# Altium schematic sheet AFE.SchDoc: Chargeur cellules lithium
size Legal; DocumentNumber: 6; SheetNumber: 6; SheetTotal: 8; Version: Gamma 1.0; Conceptor: Philippe Turgeon
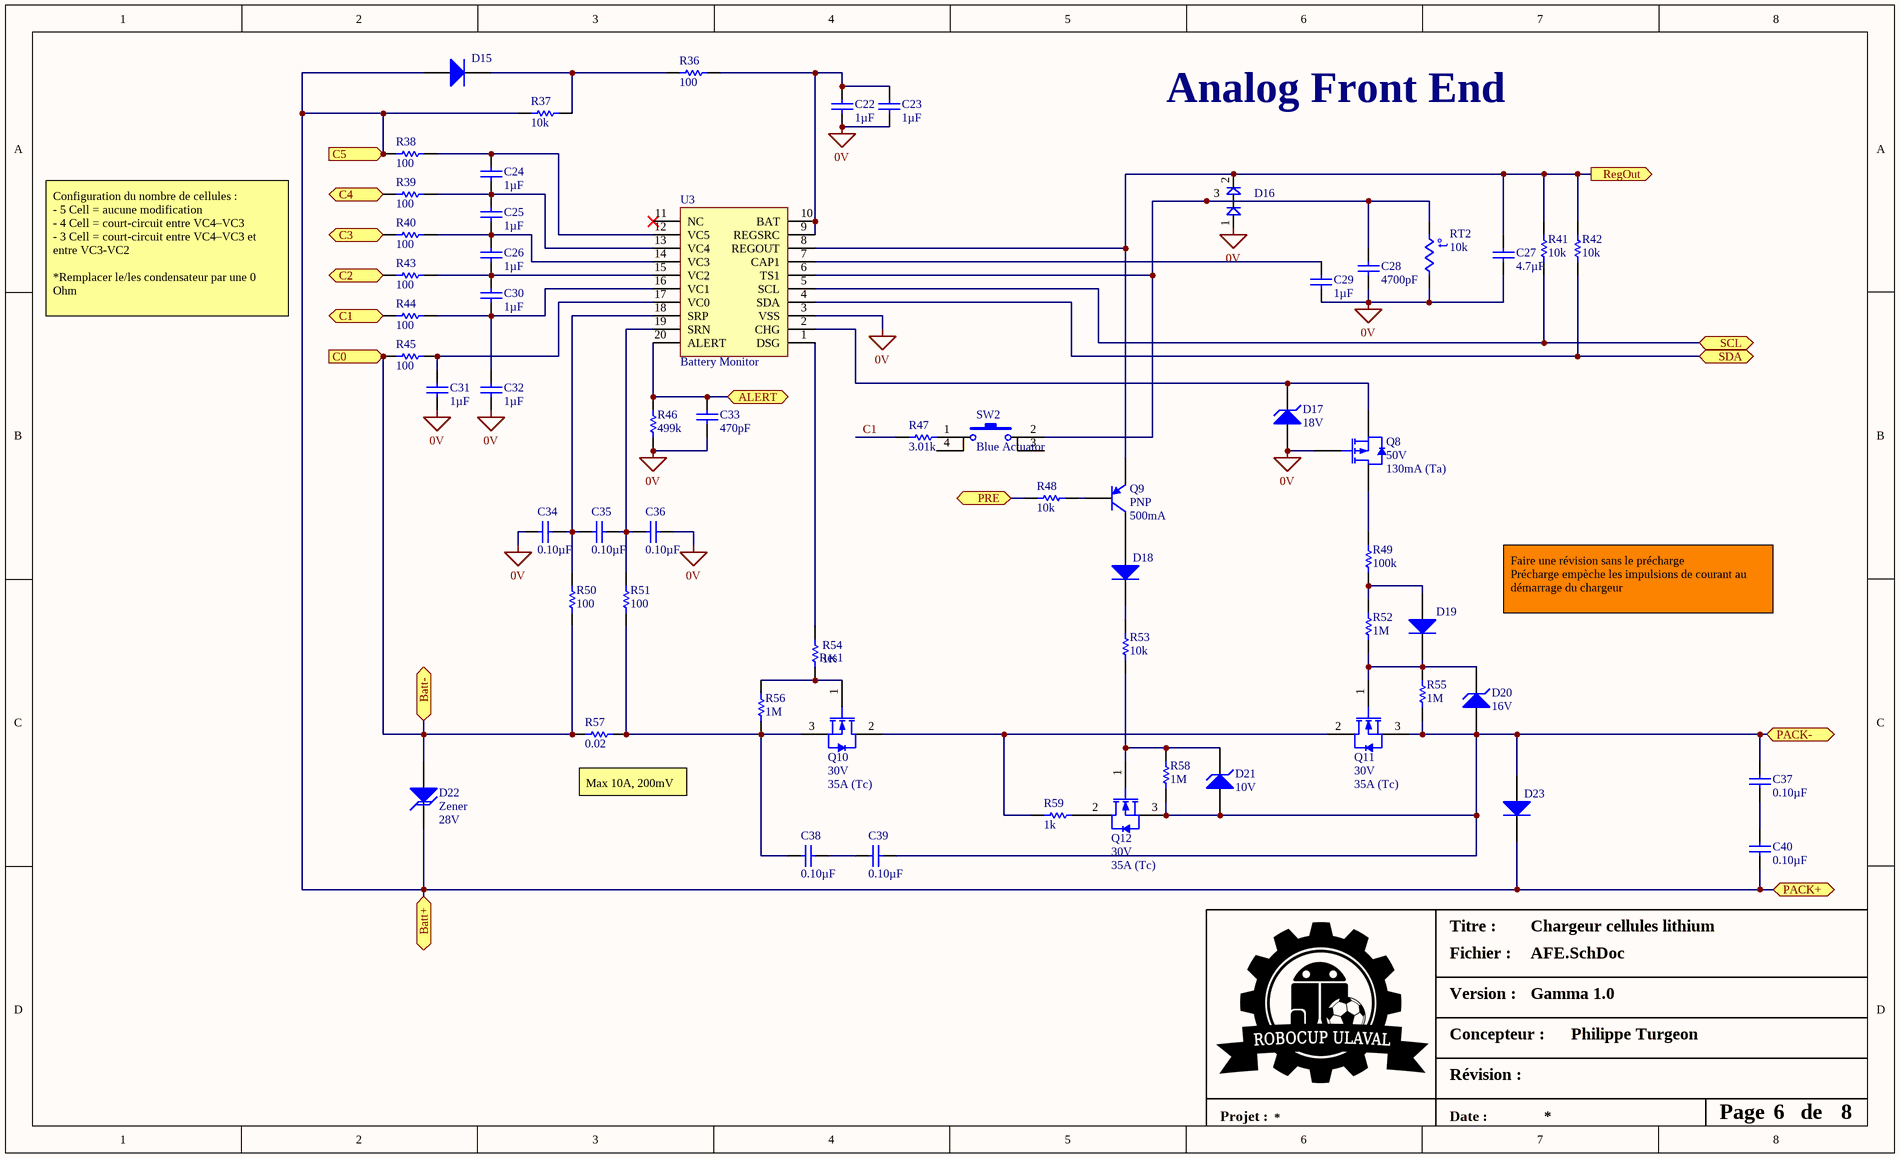
[diagram p0: AFE.SchDoc]

## Parts
C22  Capacitance: 1µF  [0805]  (hidden comment: CL21B105KBFNFNE)
C23  Capacitance: 1µF  [0805]  (hidden comment: CL21B105KBFNFNE)
C24  Capacitance: 1µF  [0805]  (hidden comment: CL21B105KBFNFNE)
C25  Capacitance: 1µF  [0805]  (hidden comment: CL21B105KBFNFNE)
C26  Capacitance: 1µF  [0805]  (hidden comment: CL21B105KBFNFNE)
C27  Capacitance: 4.7µF  [1206]  (hidden comment: CL31B475KBHNNNE)
C28  Capacitance: 4700pF  [0603]  (hidden comment: CL10B472KB8NNNC)
C29  Capacitance: 1µF  [0805]  (hidden comment: CL21B105KBFNFNE)
C30  Capacitance: 1µF  [0805]  (hidden comment: CL21B105KBFNFNE)
C31  Capacitance: 1µF  [0805]  (hidden comment: CL21B105KBFNFNE)
C32  Capacitance: 1µF  [0805]  (hidden comment: CL21B105KBFNFNE)
C33  Capacitance: 470pF  [0603]  (hidden comment: CL10B471KB8NNNC)
C34  Capacitance: 0.10µF  [0603]  (hidden comment: CL10B104KB8SFNC)
C35  Capacitance: 0.10µF  [0603]  (hidden comment: CL10B104KB8SFNC)
C36  Capacitance: 0.10µF  [0603]  (hidden comment: CL10B104KB8SFNC)
C37  Capacitance: 0.10µF  [0603]  (hidden comment: CL10B104KB8SFNC)
C38  Capacitance: 0.10µF  [0603]  (hidden comment: CL10B104KB8SFNC)
C39  Capacitance: 0.10µF  [0603]  (hidden comment: CL10B104KB8SFNC)
C40  Capacitance: 0.10µF  [0603]  (hidden comment: CL10B104KB8SFNC)
D15  1N4148W-7-F  [SOD123]  (value not drawn)
D16  BAV99LT1G  [SOT-23-3]  (value not drawn)
D17  Voltage - Zener (Nom) (Vz): 18V  [SOD-323F]  (hidden comment: DZ2J180M0L)
D18  1N4148W-7-F  [SOD123]  (value not drawn)
D19  1N4148W-7-F  [SOD123]  (value not drawn)
D20  Voltage - Zener (Nom) (Vz): 16V  [SOD-323F]  (hidden comment: DZ2J160M0L)
D21  Voltage - Zener (Nom) (Vz): 10V  [SOD-323F]  (hidden comment: DZ2J100M0L)
D22  Type: Zener  Voltage - Reverse Standoff (Typ): 28V  [SMC]  (hidden comment: SMCJ28A-TR)
D23  1N4148W-7-F  [SOD123]  (value not drawn)
Q8  Drain to Source Voltage (Vdss): 50V  Current - Continuous Drain (Id) @ 25°C: 130mA (Ta)  [SOT-23-3]  (hidden comment: BSS84-7-F)
Q9  Transistor Type: PNP  Current - Collector (Ic) (Max): 500mA  [SOT-23-3]  (hidden comment: MMBTA92LT1G)
Q10  Drain to Source Voltage (Vdss): 30V  Current - Continuous Drain (Id) @ 25°C: 35A (Tc)  [PowerPAK 1212-8]  (hidden comment: SI7114ADN-T1-GE3)
Q11  Drain to Source Voltage (Vdss): 30V  Current - Continuous Drain (Id) @ 25°C: 35A (Tc)  [PowerPAK 1212-8]  (hidden comment: SI7114ADN-T1-GE3)
Q12  Drain to Source Voltage (Vdss): 30V  Current - Continuous Drain (Id) @ 25°C: 35A (Tc)  [PowerPAK 1212-8]  (hidden comment: SI7114ADN-T1-GE3)
R36  Resistance (Ohms): 100  [0603]  (hidden comment: RC0603FR-07100RL)
R37  Resistance (Ohms): 10k  [0603]  (hidden comment: RC0603JR-0710KL)
R38  Resistance (Ohms): 100  [0603]  (hidden comment: RC0603FR-07100RL)
R39  Resistance (Ohms): 100  [0603]  (hidden comment: RC0603FR-07100RL)
R40  Resistance (Ohms): 100  [0603]  (hidden comment: RC0603FR-07100RL)
R41  Resistance (Ohms): 10k  [0603]  (hidden comment: RC0603JR-0710KL)
R42  Resistance (Ohms): 10k  [0603]  (hidden comment: RC0603JR-0710KL)
R43  Resistance (Ohms): 100  [0603]  (hidden comment: RC0603FR-07100RL)
R44  Resistance (Ohms): 100  [0603]  (hidden comment: RC0603FR-07100RL)
R45  Resistance (Ohms): 100  [0603]  (hidden comment: RC0603FR-07100RL)
R46  Resistance (Ohms): 499k  [0603]  (hidden comment: RC0603FR-07499KL)
R47  Resistance (Ohms): 3.01k  [0603]  (hidden comment: RC0603FR-073K01L)
R48  Resistance (Ohms): 10k  [0603]  (hidden comment: RC0603JR-0710KL)
R49  Resistance (Ohms): 100k  [0603]  (hidden comment: RC0603JR-07100KL)
R50  Resistance (Ohms): 100  [0603]  (hidden comment: RC0603FR-07100RL)
R51  Resistance (Ohms): 100  [0603]  (hidden comment: RC0603FR-07100RL)
R52  Resistance (Ohms): 1M  [0603]  (hidden comment: RC0603FR-071ML)
R53  Resistance (Ohms): 10k  [0603]  (hidden comment: RC0603JR-0710KL)
R54  Res1  value 1K  [AXIAL-0.3]
R55  Resistance (Ohms): 1M  [0603]  (hidden comment: RC0603FR-071ML)
R56  Resistance (Ohms): 1M  [0603]  (hidden comment: RC0603FR-071ML)
R57  Resistance (Ohms): 0.02  (hidden comment: CRA2512-FZ-R020ELF)
R58  Resistance (Ohms): 1M  [0603]  (hidden comment: RC0603FR-071ML)
R59  Resistance (Ohms): 1k  [0603]  (hidden comment: RC0603JR-071KL)
RT2  Resistance in Ohms @ 25°C: 10k  [NTCLE100E3]  (hidden comment: NTCLE100E3103HT1)
SW2  Features: Blue Actuator  [6 mm Tact Switches]  (hidden comment: PTS645SM43SMTR92 LFS)
U3  Function: Battery Monitor  [TSSOP-20]  (hidden comment: BQ7692003PWR)

## Ports
ALERT, Batt+, Batt-, C0 (in), C1 (in), C2 (in), C3 (in), C4 (in), C5 (in), PACK+, PACK-, PRE, RegOut (out), SCL, SDA

## Nets
0V: C22.1 C23.1 C27.1 C28.1 C29.1 C31.1 C32.1 C33.1 C34.2 C36.1 D16.1(bottom) D17.1(A) Q8.1(G) R46.1 RT2.2 U3.3(VSS)
ALERT: C33.2 R46.2 U3.20(ALERT) ; port ALERT
Batt+: C40.2 D15.1(A) D22.2(K) D23.2(K) R37.1 R38.1 ; port Batt+, port PACK+, port C5
Batt-: D22.1(A) R45.1 R50.1 R57.1 ; port C0, port Batt-
C1: R44.1 ; port C1
C1: R47.1  [a separate net that carries the same name]
C2: R43.1 ; port C2
C3: R40.1 ; port C3
C4: R39.1 ; port C4
PACK-: C37.1 C39.1 D20.1(A) D21.1(A) D23.1(A) Q11.3(S) Q12.3(S) R55.1 R58.1 ; port PACK-
PRE: R48.2 ; port PRE
RegOut: C27.2 D16.2(top) Q9.3(E) R41.2 R42.2 U3.8(REGOUT) ; port RegOut
SCL: R41.1 U3.5(SCL) ; port SCL
SDA: R42.1 U3.4(SDA) ; port SDA
NetC22_2: C22.2 C23.2 R36.2 U3.9(REGSRC) U3.10(BAT)
NetC24_1: C24.1 C25.2 R39.2 U3.13(VC4)
NetC24_2: C24.2 R38.2 U3.12(VC5)
NetC25_1: C25.1 C26.2 R40.2 U3.14(VC3)
NetC26_1: C26.1 C30.2 R43.2 U3.15(VC2)
NetC28_2: C28.2 D16.3(center) RT2.1 SW2.2 U3.6(TS1)
NetC29_2: C29.2 U3.7(CAP1)
NetC30_1: C30.1 C32.2 R44.2 U3.16(VC1)
NetC31_2: C31.2 R45.2 U3.17(VC0)
NetC34_1: C34.1 C35.2 R50.2 U3.18(SRP)
NetC35_1: C35.1 C36.2 R51.2 U3.19(SRN)
NetC37_2: C37.2 C40.1
NetC38_1: C38.1 C39.2
NetC38_2: C38.2 Q10.3(S) R51.1 R56.1 R57.2
NetD15_2: D15.2(K) R36.1 R37.2
NetD17_2: D17.2(K) Q8.3(S) U3.2(CHG)
NetD18_1: D18.1(A) Q9.1(C)
NetD18_2: D18.2(K) R53.2
NetD19_1: D19.1(A) R49.1 R52.2
NetD19_2: D19.2(K) D20.2(K) Q11.1(G) R52.1 R55.2
NetD21_2: D21.2(K) Q12.1(G) R53.1 R58.2
NetQ8_2: Q8.2(D) R49.2
NetQ9_2: Q9.2(B) R48.1
NetQ10_1: Q10.1(G) R54.1 R56.2
NetQ10_2: Q10.2(D) Q11.2(D) R59.1
NetQ12_2: Q12.2(D) R59.2
NetR54_2: R54.2 U3.1(DSG)

Not connected (* = marked no-connect by the designer): R47 2; SW2 1 3 4; U3 11(NC)*

## Notes on the sheet
- Analog Front End
- Configuration du nombre de cellules :
  - 5 Cell = aucune modification
  - 4 Cell = court-circuit entre VC4–VC3
  - 3 Cell = court-circuit entre VC4–VC3 et entre VC3-VC2
  *Remplacer le/les condensateur par une 0 Ohm
- Faire une révision sans le précharge
  Précharge empèche les impulsions de courant au démarrage du chargeur
- (near R57) Max 10A, 200mV
- Titre :
- Fichier :
- Version :
- Concepteur :
- Révision :
- Projet :
- Date :
- Page
- de
- (in symbol NTCLE100E3103HT1) t°

## Library data of the parts
C22-C26 C29-C32 = CL21B105KBFNFNE: CAP CER 1UF 50V X7R 0805; Manufacturer: Samsung Electro-Mechanics America, Inc.; Tolerance: ±10%; Supplier 1: Digi-Key; Manufacturer Part Number: CL21B105KBFNFNE; RoHS: RoHS Compliant; Stock 1: 21699; Pricing 1: 1=0.27, 10=0.186, 25=0.14, 50=0.1072, 100=0.0884, 500=0.06238, 1000=0.05123 (CAD); Packaging: Cut Tape (CT); Voltage - Rated: 50V; Temperature Coefficient: X7R; Mounting Type: Surface Mount, MLCC; Operating Temperature: -55°C ~ 125°C; Applications: General Purpose; Ratings: -; Package / Case: 0805 (2012 Metric); Size / Dimension: 0.079" L x 0.049" W (2.00mm x 1.25mm); Height - Seated (Max): -; Thickness (Max): 0.053" (1.35mm); Lead Spacing: -; Features: -; Lead Style: -; ComponentLink1URL: http://www.samsungsem.com/kr/support/product-search/mlcc/CL21B105KBFNFNE.jsp; ComponentLink1Description: http://www.samsungsem.com/kr/support/product-search/mlcc/CL21B105KBFNFNE.jsp; Supplier Part Number 1: 1276-2928-1-ND; Category: Capacitors
C27 = CL31B475KBHNNNE: CAP CER 4.7UF 50V X7R 1206; Manufacturer: Samsung Electro-Mechanics America, Inc.; Tolerance: ±10%; Supplier 1: Digi-Key; Manufacturer Part Number: CL31B475KBHNNNE; RoHS: RoHS Compliant; Category: Capacitors; Stock 1: 130734; Pricing 1: 1=0.48, 10=0.398, 25=0.274, 50=0.224, 100=0.1992, 500=0.13194, 1000=0.11701 (CAD); Packaging: Cut Tape (CT); Voltage - Rated: 50V; Temperature Coefficient: X7R; Mounting Type: Surface Mount, MLCC; Operating Temperature: -55°C ~ 125°C; Applications: General Purpose; Ratings: -; Package / Case: 1206 (3216 Metric); Size / Dimension: 0.126" L x 0.063" W (3.20mm x 1.60mm); Height - Seated (Max): -; Thickness (Max): 0.071" (1.80mm); Lead Spacing: -; Features: -; Lead Style: -; ComponentLink1URL: http://www.samsungsem.com/kr/support/product-search/mlcc/CL31B475KBHNNNE.jsp; ComponentLink1Description: http://www.samsungsem.com/kr/support/product-search/mlcc/CL31B475KBHNNNE.jsp; Supplier Part Number 1: 1276-2789-1-ND
C28 = CL10B472KB8NNNC: CAP CER 4700PF 50V X7R 0603; Manufacturer: Samsung Electro-Mechanics America, Inc.; Tolerance: ±10%; Supplier 1: Digi-Key; Manufacturer Part Number: CL10B472KB8NNNC; RoHS: RoHS Compliant; Category: Capacitors; Stock 1: 159154; Pricing 1: 1=0.14, 10=0.034, 25=0.0244, 50=0.0188, 100=0.0159, 500=0.01118, 1000=0.0087 (CAD); Packaging: Cut Tape (CT); Voltage - Rated: 50V; Temperature Coefficient: X7R; Mounting Type: Surface Mount, MLCC; Operating Temperature: -55°C ~ 125°C; Applications: General Purpose; Ratings: -; Package / Case: 0603 (1608 Metric); Size / Dimension: 0.063" L x 0.031" W (1.60mm x 0.80mm); Height - Seated (Max): -; Thickness (Max): 0.035" (0.90mm); Lead Spacing: -; Features: -; Lead Style: -; ComponentLink1URL: http://www.samsungsem.com/kr/support/product-search/mlcc/CL10B472KB8NNNC.jsp; ComponentLink1Description: http://www.samsungsem.com/kr/support/product-search/mlcc/CL10B472KB8NNNC.jsp; Supplier Part Number 1: 1276-1098-1-ND
C33 = CL10B471KB8NNNC: CAP CER 470PF 50V X7R 0603; Manufacturer: Samsung Electro-Mechanics America, Inc.; Tolerance: ±10%; Supplier 1: Digi-Key; Manufacturer Part Number: CL10B471KB8NNNC; RoHS: RoHS Compliant; Category: Capacitors; Stock 1: 165536; Pricing 1: 1=0.14, 10=0.043, 25=0.0296, 50=0.0228, 100=0.0192, 500=0.01348, 1000=0.01049 (CAD); Packaging: Cut Tape (CT); Voltage - Rated: 50V; Temperature Coefficient: X7R; Mounting Type: Surface Mount, MLCC; Operating Temperature: -55°C ~ 125°C; Applications: General Purpose; Ratings: -; Package / Case: 0603 (1608 Metric); Size / Dimension: 0.063" L x 0.031" W (1.60mm x 0.80mm); Height - Seated (Max): -; Thickness (Max): 0.035" (0.90mm); Lead Spacing: -; Features: -; Lead Style: -; ComponentLink1URL: http://www.samsungsem.com/kr/support/product-search/mlcc/CL10B471KB8NNNC.jsp; ComponentLink1Description: http://www.samsungsem.com/kr/support/product-search/mlcc/CL10B471KB8NNNC.jsp; Supplier Part Number 1: 1276-1094-1-ND
C34-C40 = CL10B104KB8SFNC: CAP CER 0.1UF 50V X7R 0603; Manufacturer: Samsung Electro-Mechanics America, Inc.; Tolerance: ±10%; Supplier 1: Digi-Key; Manufacturer Part Number: CL10B104KB8SFNC; RoHS: RoHS Compliant; Category: Capacitors; Stock 1: 2612665; Pricing 1: 1=0.14, 10=0.028, 25=0.0204, 50=0.0156, 100=0.0127, 250=0.01064, 500=0.00908, 1000=0.00712 (CAD); Packaging: Cut Tape (CT); Voltage - Rated: 50V; Temperature Coefficient: X7R; Mounting Type: Surface Mount, MLCC; Operating Temperature: -55°C ~ 125°C; Applications: Boardflex Sensitive; Ratings: -; Package / Case: 0603 (1608 Metric); Size / Dimension: 0.063" L x 0.031" W (1.60mm x 0.80mm); Height - Seated (Max): -; Thickness (Max): 0.035" (0.90mm); Lead Spacing: -; Features: Soft Termination; Lead Style: -; ComponentLink1URL: http://www.samsungsem.com/kr/support/product-search/mlcc/CL10B104KB8SFNC.jsp; ComponentLink1Description: http://www.samsungsem.com/kr/support/product-search/mlcc/CL10B104KB8SFNC.jsp; Supplier Part Number 1: 1276-1936-1-ND
D15 D18 D19 D23 = 1N4148W-7-F: DIODE GEN PURP 100V 300MA SOD123; Manufacturer: Diodes Incorporated; Diode Type: Standard; Current - Average Rectified (Io): 300mA (DC); Voltage - Forward (Vf) (Max) @ If: 1.25V @ 150mA; Speed: Small Signal =< 200mA (Io), Any Speed; Reverse Recovery Time (trr): 4ns; Current - Reverse Leakage @ Vr: 1µA @ 75V; Capacitance @ Vr, F: 2pF @ 0V, 1MHz; Supplier 1: Digi-Key; Supplier Part Number 1: 1N4148W-FDICT-ND; Manufacturer Part Number: 1N4148W-7-F; RoHS: RoHS Compliant; Category: Discrete Semiconductor Products; Stock 1: 876946; Pricing 1: 1=0.23, 10=0.212, 100=0.1153, 500=0.07086, 1000=0.04833 (CAD); Packaging: Cut Tape (CT); Voltage - DC Reverse (Vr) (Max): 100V; Mounting Type: Surface Mount; Package / Case: SOD-123; Supplier Device Package: SOD-123; Operating Temperature - Junction: -65°C ~ 150°C; ComponentLink1URL: http://www.diodes.com/_files/datasheets/ds30086.pdf; ComponentLink1Description: http://www.diodes.com/_files/datasheets/ds30086.pdf
D16 = BAV99LT1G: DIODE ARRAY GP 70V 215MA SOT23-3; Manufacturer: ON Semiconductor; Diode Configuration: 1 Pair Series Connection; Diode Type: Standard; Current - Average Rectified (Io) (per Diode): 215mA (DC); Voltage - Forward (Vf) (Max) @ If: 1.25V @ 150mA; Speed: Fast Recovery =< 500ns, > 200mA (Io); Reverse Recovery Time (trr): 6ns; Current - Reverse Leakage @ Vr: 2.5µA @ 70V; Supplier 1: Digi-Key; Supplier Part Number 1: BAV99LT1GOSCT-ND; Manufacturer Part Number: BAV99LT1G; RoHS: RoHS Compliant; Category: Discrete Semiconductor Products; Stock 1: 204227; Pricing 1: 1=0.17, 10=0.158, 100=0.0859, 500=0.0528, 1000=0.03603 (CAD); Packaging: Cut Tape (CT); Voltage - DC Reverse (Vr) (Max): 70V; Mounting Type: Surface Mount; Package / Case: TO-236-3, SC-59, SOT-23-3; Supplier Device Package: SOT-23-3 (TO-236); ComponentLink1URL: http://www.onsemi.com/pub_link/Collateral/BAV99LT1-D.PDF; ComponentLink1Description: http://www.onsemi.com/pub_link/Collateral/BAV99LT1-D.PDF
D17 = DZ2J180M0L: DIODE ZENER 18V 200MW SMINI2; Manufacturer: Panasonic Electronic Components; Tolerance: ±5%; Impedance (Max) (Zzt): 60 Ohm; Current - Reverse Leakage @ Vr: 50nA @ 13V; Voltage - Forward (Vf) (Max) @ If: 1V @ 10mA; Supplier 1: Digi-Key; Supplier Part Number 1: DZ2J180M0LCT-ND; Manufacturer Part Number: DZ2J180M0L; RoHS: RoHS Compliant; Category: Discrete Semiconductor Products; Stock 1: 7928; Pricing 1: 1=0.14, 10=0.055, 25=0.0448, 100=0.035, 250=0.034, 500=0.03304, 1000=0.03003 (CAD); Packaging: Cut Tape (CT); Power - Max: 200mW; Operating Temperature: -; Mounting Type: Surface Mount; Package / Case: SC-90, SOD-323F; Supplier Device Package: SMini2-F5-B; ComponentLink1URL: http://media.digikey.com/pdf/Data%20Sheets/Panasonic%20Semiconductors%20ICs%20PDFs/DZ2J180.pdf; ComponentLink1Description: http://media.digikey.com/pdf/Data%20Sheets/Panasonic%20Semiconductors%20ICs%20PDFs/DZ2J180.pdf
D20 = DZ2J160M0L: DIODE ZENER 16V 200MW SMINI2; Manufacturer: Panasonic Electronic Components; Tolerance: ±5%; Impedance (Max) (Zzt): 50 Ohm; Current - Reverse Leakage @ Vr: 50nA @ 12V; Voltage - Forward (Vf) (Max) @ If: 1V @ 10mA; Supplier 1: Digi-Key; Supplier Part Number 1: DZ2J160M0LCT-ND; Manufacturer Part Number: DZ2J160M0L; RoHS: RoHS Compliant; Category: Discrete Semiconductor Products; Stock 1: 10539; Pricing 1: 1=0.14, 10=0.055, 25=0.0448, 100=0.035, 250=0.034, 500=0.03304, 1000=0.03003 (CAD); Packaging: Cut Tape (CT); Power - Max: 200mW; Operating Temperature: -; Mounting Type: Surface Mount; Package / Case: SC-90, SOD-323F; Supplier Device Package: SMini2-F5-B; ComponentLink1URL: http://industrial.panasonic.com/www-cgi/jvcr13pz.cgi?E+SC+4+CDH7004+DZ2J160+8+WW; ComponentLink1Description: http://industrial.panasonic.com/www-cgi/jvcr13pz.cgi?E+SC+4+CDH7004+DZ2J160+8+WW
D21 = DZ2J100M0L: DIODE ZENER 10V 200MW SMINI2; Manufacturer: Panasonic Electronic Components; Tolerance: ±5%; Impedance (Max) (Zzt): 30 Ohm; Current - Reverse Leakage @ Vr: 50nA @ 7V; Voltage - Forward (Vf) (Max) @ If: 1V @ 10mA; Supplier 1: Digi-Key; Supplier Part Number 1: DZ2J100M0LCT-ND; Manufacturer Part Number: DZ2J100M0L; RoHS: RoHS Compliant; Category: Discrete Semiconductor Products; Stock 1: 18966; Pricing 1: 1=0.14, 10=0.055, 25=0.0448, 100=0.035, 250=0.034, 500=0.03304, 1000=0.03003 (CAD); Packaging: Cut Tape (CT); Power - Max: 200mW; Operating Temperature: -; Mounting Type: Surface Mount; Package / Case: SC-90, SOD-323F; Supplier Device Package: SMini2-F5-B; ComponentLink1URL: http://industrial.panasonic.com/www-cgi/jvcr13pz.cgi?E+SC+4+CDH7004+DZ2J100+8+WW; ComponentLink1Description: http://industrial.panasonic.com/www-cgi/jvcr13pz.cgi?E+SC+4+CDH7004+DZ2J100+8+WW
D22 = SMCJ28A-TR: TVS DIODE 28VWM 59VC SMC; Manufacturer: STMicroelectronics; Unidirectional Channels: 1; Voltage - Breakdown (Min): 31.1V; Voltage - Clamping (Max) @ Ipp: 59V; Current - Peak Pulse (10/1000µs): 169A (8/20µs); Power - Peak Pulse: 1500W (1.5kW); Power Line Protection: No; Supplier 1: Digi-Key; Supplier Part Number 1: 497-15789-1-ND; Manufacturer Part Number: SMCJ28A-TR; RoHS: RoHS Compliant; Category: Circuit Protection; Stock 1: 4619; Pricing 1: 1=0.63, 10=0.539, 100=0.4027, 500=0.3163, 1000=0.24384 (CAD); Packaging: Cut Tape (CT); Bidirectional Channels: -; Applications: General Purpose; Capacitance @ Frequency: -; Operating Temperature: -55°C ~ 150°C (TJ); Mounting Type: Surface Mount; Package / Case: DO-214AB, SMC; Supplier Device Package: SMC (DO-214AB); ComponentLink1URL: http://www.st.com/web/en/resource/technical/document/datasheet/CD00001367.pdf; ComponentLink1Description: http://www.st.com/web/en/resource/technical/document/datasheet/CD00001367.pdf
Q8 = BSS84-7-F: MOSFET P-CH 50V 130MA SOT23-3; Manufacturer: Diodes Incorporated; FET Type: MOSFET P-Channel, Metal Oxide; FET Feature: Standard; Rds On (Max) @ Id, Vgs: 10 Ohm @ 100mA, 5V; Vgs(th) (Max) @ Id: 2V @ 1mA; Input Capacitance (Ciss) @ Vds: 45pF @ 25V; Power - Max: 300mW; Supplier 1: Digi-Key; Supplier Part Number 1: BSS84-FDICT-ND; Manufacturer Part Number: BSS84-7-F; RoHS: RoHS Compliant; Category: Discrete Semiconductor Products; Stock 1: 64867; Pricing 1: 1=0.34, 10=0.276, 100=0.146, 500=0.09606, 1000=0.06545 (CAD); Packaging: Cut Tape (CT); Gate Charge (Qg) @ Vgs: -; Operating Temperature: -55°C ~ 150°C (TJ); Mounting Type: Surface Mount; Package / Case: TO-236-3, SC-59, SOT-23-3; Supplier Device Package: SOT-23-3; ComponentLink1URL: http://www.diodes.com/_files/datasheets/ds30149.pdf; ComponentLink1Description: http://www.diodes.com/_files/datasheets/ds30149.pdf
Q9 = MMBTA92LT1G: TRANS PNP 300V 0.5A SOT23; Manufacturer: ON Semiconductor; Vce Saturation (Max) @ Ib, Ic: 500mV @ 2mA, 20mA; Current - Collector Cutoff (Max): 250nA (ICBO); DC Current Gain (hFE) (Min) @ Ic, Vce: 25 @ 30mA, 10V; Power - Max: 300mW; Frequency - Transition: 50MHz; Supplier 1: Digi-Key; Supplier Part Number 1: MMBTA92LT1GOSCT-ND; Manufacturer Part Number: MMBTA92LT1G; RoHS: RoHS Compliant; Category: Discrete Semiconductor Products; Stock 1: 2785; Pricing 1: 1=0.28, 10=0.262, 100=0.1425, 500=0.08758, 1000=0.05974 (CAD); Packaging: Cut Tape (CT); Voltage - Collector Emitter Breakdown (Max): 300V; Mounting Type: Surface Mount; Package / Case: TO-236-3, SC-59, SOT-23-3; Supplier Device Package: SOT-23-3 (TO-236); ComponentLink1URL: http://www.onsemi.com/pub_link/Collateral/MMBTA92LT1-D.PDF; ComponentLink1Description: http://www.onsemi.com/pub_link/Collateral/MMBTA92LT1-D.PDF
Q10-Q12 = SI7114ADN-T1-GE3: MOSFET N-CH 30V 35A PPAK 1212-8; Manufacturer: Vishay Siliconix; FET Type: MOSFET N-Channel, Metal Oxide; FET Feature: Standard; Rds On (Max) @ Id, Vgs: 7.5 mOhm @ 18A, 10V; Vgs(th) (Max) @ Id: 2.5V @ 250µA; Gate Charge (Qg) @ Vgs: 32nC @ 10V; Input Capacitance (Ciss) @ Vds: 1230pF @ 15V; Power - Max: 39W; Supplier 1: Digi-Key; Supplier Part Number 1: SI7114ADN-T1-GE3CT-ND; Manufacturer Part Number: SI7114ADN-T1-GE3; RoHS: RoHS Compliant; Category: Discrete Semiconductor Products; Stock 1: 3921; Pricing 1: 1=1.32, 10=1.16, 25=1.0896, 100=0.8892, 250=0.82596, 500=0.70294, 1000=0.56235 (CAD); Packaging: Cut Tape (CT); Operating Temperature: -55°C ~ 150°C (TJ); Mounting Type: Surface Mount; Package / Case: PowerPAK® 1212-8; Supplier Device Package: PowerPAK® 1212-8; ComponentLink1URL: http://www.vishay.com/docs/68932/si7114ad.pdf; ComponentLink1Description: http://www.vishay.com/docs/68932/si7114ad.pdf
R36 R38-R40 R43-R45 R50 R51 = RC0603FR-07100RL: RES SMD 100 OHM 1% 1/10W 0603; Manufacturer: Yageo; Power (Watts): 0.1W, 1/10W; Temperature Coefficient: ±100ppm/°C; Supplier 1: Digi-Key; Manufacturer Part Number: RC0603FR-07100RL; RoHS: RoHS Compliant; Category: Resistors; Stock 1: 2558990; Pricing 1: 1=0.15, 10=0.021, 25=0.0152, 100=0.0086, 250=0.0066, 500=0.00526, 1000=0.00389, 2500=0.00337 (CAD); Packaging: Cut Tape (CT); Tolerance: ±1%; Composition: Thick Film; Features: Moisture Resistant; Operating Temperature: -55°C ~ 155°C; Package / Case: 0603 (1608 Metric); Supplier Device Package: 0603; Size / Dimension: 0.063" L x 0.031" W (1.60mm x 0.80mm); Height: 0.022" (0.55mm); Number of Terminations: 2; ComponentLink1URL: http://www.yageo.com/documents/recent/PYu-RC_Group_51_RoHS_L_04.pdf; ComponentLink1Description: http://www.yageo.com/documents/recent/PYu-RC_Group_51_RoHS_L_04.pdf; Supplier Part Number 1: 311-100HRCT-ND
R37 R41 R42 R48 R53 = RC0603JR-0710KL: RES SMD 10K OHM 5% 1/10W 0603; Manufacturer: Yageo; Power (Watts): 0.1W, 1/10W; Temperature Coefficient: ±100ppm/°C; Supplier 1: Digi-Key; Manufacturer Part Number: RC0603JR-0710KL; RoHS: RoHS Compliant; Category: Resistors; Stock 1: 5547866; Pricing 1: 1=0.15, 10=0.017, 25=0.012, 100=0.0067, 250=0.00508, 500=0.00408, 1000=0.003, 2500=0.0026 (CAD); Packaging: Cut Tape (CT); Tolerance: ±5%; Composition: Thick Film; Features: Moisture Resistant; Operating Temperature: -55°C ~ 155°C; Package / Case: 0603 (1608 Metric); Supplier Device Package: 0603; Size / Dimension: 0.063" L x 0.031" W (1.60mm x 0.80mm); Height: 0.022" (0.55mm); Number of Terminations: 2; ComponentLink1URL: http://www.yageo.com/documents/recent/PYu-RC_Group_51_RoHS_L_04.pdf; ComponentLink1Description: http://www.yageo.com/documents/recent/PYu-RC_Group_51_RoHS_L_04.pdf; Supplier Part Number 1: 311-10KGRCT-ND
R46 = RC0603FR-07499KL: RES SMD 499K OHM 1% 1/10W 0603; Manufacturer: Yageo; Power (Watts): 0.1W, 1/10W; Temperature Coefficient: ±100ppm/°C; Supplier 1: Digi-Key; Manufacturer Part Number: RC0603FR-07499KL; RoHS: RoHS Compliant; Category: Resistors; Stock 1: 174697; Pricing 1: 1=0.15, 10=0.021, 25=0.0152, 100=0.0086, 250=0.0066, 500=0.00526, 1000=0.00389, 2500=0.00337 (CAD); Packaging: Cut Tape (CT); Tolerance: ±1%; Composition: Thick Film; Features: Moisture Resistant; Operating Temperature: -55°C ~ 155°C; Package / Case: 0603 (1608 Metric); Supplier Device Package: 0603; Size / Dimension: 0.063" L x 0.031" W (1.60mm x 0.80mm); Height: 0.022" (0.55mm); Number of Terminations: 2; ComponentLink1URL: http://www.yageo.com/documents/recent/PYu-RC_Group_51_RoHS_L_04.pdf; ComponentLink1Description: http://www.yageo.com/documents/recent/PYu-RC_Group_51_RoHS_L_04.pdf; Supplier Part Number 1: 311-499KHRCT-ND
R47 = RC0603FR-073K01L: RES SMD 3.01K OHM 1% 1/10W 0603; Manufacturer: Yageo; Power (Watts): 0.1W, 1/10W; Temperature Coefficient: ±100ppm/°C; Supplier 1: Digi-Key; Manufacturer Part Number: RC0603FR-073K01L; RoHS: RoHS Compliant; Category: Resistors; Stock 1: 598103; Pricing 1: 1=0.15, 10=0.021, 25=0.0152, 100=0.0086, 250=0.0066, 500=0.00526, 1000=0.00389, 2500=0.00337 (CAD); Packaging: Cut Tape (CT); Tolerance: ±1%; Composition: Thick Film; Features: Moisture Resistant; Operating Temperature: -55°C ~ 155°C; Package / Case: 0603 (1608 Metric); Supplier Device Package: 0603; Size / Dimension: 0.063" L x 0.031" W (1.60mm x 0.80mm); Height: 0.022" (0.55mm); Number of Terminations: 2; ComponentLink1URL: http://www.yageo.com/documents/recent/PYu-RC_Group_51_RoHS_L_04.pdf; ComponentLink1Description: http://www.yageo.com/documents/recent/PYu-RC_Group_51_RoHS_L_04.pdf; Supplier Part Number 1: 311-3.01KHRCT-ND
R49 = RC0603JR-07100KL: RES SMD 100K OHM 5% 1/10W 0603; Manufacturer: Yageo; Power (Watts): 0.1W, 1/10W; Temperature Coefficient: ±100ppm/°C; Supplier 1: Digi-Key; Manufacturer Part Number: RC0603JR-07100KL; RoHS: RoHS Compliant; Category: Resistors; Stock 1: 2803334; Pricing 1: 1=0.15, 10=0.017, 25=0.012, 100=0.0067, 250=0.00508, 500=0.00408, 1000=0.003, 2500=0.0026 (CAD); Packaging: Cut Tape (CT); Tolerance: ±5%; Composition: Thick Film; Features: Moisture Resistant; Operating Temperature: -55°C ~ 155°C; Package / Case: 0603 (1608 Metric); Supplier Device Package: 0603; Size / Dimension: 0.063" L x 0.031" W (1.60mm x 0.80mm); Height: 0.022" (0.55mm); Number of Terminations: 2; ComponentLink1URL: http://www.yageo.com/documents/recent/PYu-RC_Group_51_RoHS_L_04.pdf; ComponentLink1Description: http://www.yageo.com/documents/recent/PYu-RC_Group_51_RoHS_L_04.pdf; Supplier Part Number 1: 311-100KGRCT-ND
R52 R55 R56 R58 = RC0603FR-071ML: RES SMD 1M OHM 1% 1/10W 0603; Manufacturer: Yageo; Power (Watts): 0.1W, 1/10W; Temperature Coefficient: ±100ppm/°C; Supplier 1: Digi-Key; Manufacturer Part Number: RC0603FR-071ML; RoHS: RoHS Compliant; Category: Resistors; Stock 1: 1571699; Pricing 1: 1=0.15, 10=0.021, 25=0.0152, 100=0.0086, 250=0.0066, 500=0.00526, 1000=0.00389, 2500=0.00337 (CAD); Packaging: Cut Tape (CT); Tolerance: ±1%; Composition: Thick Film; Features: Moisture Resistant; Operating Temperature: -55°C ~ 155°C; Package / Case: 0603 (1608 Metric); Supplier Device Package: 0603; Size / Dimension: 0.063" L x 0.031" W (1.60mm x 0.80mm); Height: 0.022" (0.55mm); Number of Terminations: 2; ComponentLink1URL: http://www.yageo.com/documents/recent/PYu-RC_Group_51_RoHS_L_04.pdf; ComponentLink1Description: http://www.yageo.com/documents/recent/PYu-RC_Group_51_RoHS_L_04.pdf; Supplier Part Number 1: 311-1.00MHRCT-ND
R54 = Res1: Resistor; Published: 8-Jun-2000; LatestRevisionDate: 17-Jul-2002; LatestRevisionNote: Re-released for DXP Platform.; PackageReference: AXIAL-0.3; Publisher: Altium Limited; PackageDescription: Axial Device, Thru-Hole; 2 Leads; 0.3 in Pin Spacing
R57 = CRA2512-FZ-R020ELF: RES SMD 0.02 OHM 1% 3W 2512; Manufacturer: Bourns Inc.; Temperature Coefficient: ±75ppm/°C; Supplier 1: Digi-Key; Manufacturer Part Number: CRA2512-FZ-R020ELF; RoHS: RoHS Compliant; Category: Resistors; Stock 1: 18215; Pricing 1: 1=0.91, 10=0.759, 25=0.65, 50=0.5848, 100=0.5089, 250=0.45468, 500=0.36806, 1000=0.29771 (CAD); Packaging: Cut Tape (CT); Tolerance: ±1%; Power (Watts): 3W; Composition: Metal Film; Features: Automotive AEC-Q200, Current Sense, Moisture Resistant; Operating Temperature: -55°C ~ 170°C; Package / Case: 2512 (6432 Metric); Supplier Device Package: 2512; Size / Dimension: 0.254" L x 0.132" W (6.45mm x 3.35mm); Height: 0.035" (0.90mm); Number of Terminations: 2; ComponentLink1URL: http://www.bourns.com/docs/Product-Datasheets/CRA.pdf; ComponentLink1Description: http://www.bourns.com/docs/Product-Datasheets/CRA.pdf; Supplier Part Number 1: CRA2512-FZ-R020ELFCT-ND
R59 = RC0603JR-071KL: RES SMD 1K OHM 5% 1/10W 0603; Manufacturer: Yageo; Power (Watts): 0.1W, 1/10W; Temperature Coefficient: ±100ppm/°C; Supplier 1: Digi-Key; Manufacturer Part Number: RC0603JR-071KL; RoHS: RoHS Compliant; Category: Resistors; Stock 1: 1078221; Pricing 1: 1=0.15, 10=0.017, 25=0.012, 100=0.0067, 250=0.00508, 500=0.00408, 1000=0.003, 2500=0.0026 (CAD); Packaging: Cut Tape (CT); Tolerance: ±5%; Composition: Thick Film; Features: Moisture Resistant; Operating Temperature: -55°C ~ 155°C; Package / Case: 0603 (1608 Metric); Supplier Device Package: 0603; Size / Dimension: 0.063" L x 0.031" W (1.60mm x 0.80mm); Height: 0.022" (0.55mm); Number of Terminations: 2; ComponentLink1URL: http://www.yageo.com/documents/recent/PYu-RC_Group_51_RoHS_L_04.pdf; ComponentLink1Description: http://www.yageo.com/documents/recent/PYu-RC_Group_51_RoHS_L_04.pdf; Supplier Part Number 1: 311-1.0KGRCT-ND
RT2 = NTCLE100E3103HT1: THERMISTOR NTC 10K 3% RADIAL; Manufacturer: Vishay BC Components; B Value Tolerance: ±0.75%; B25/85: 3977K; Power - Max: 500mW; Supplier 1: Digi-Key; Supplier Part Number 1: BC2395CT-ND; Manufacturer Part Number: NTCLE100E3103HT1; RoHS: RoHS Compliant; Category: Sensors, Transducers; Stock 1: 32497; Pricing 1: 1=0.68, 10=0.465, 50=0.4382, 100=0.3903, 250=0.38336, 500=0.36284 (CAD); Packaging: Cut Tape (CT); Resistance Tolerance: ±3%; B0/50: -; B25/50: -; B25/75: -; B25/100: -; Operating Temperature: -40°C ~ 125°C; Length - Lead Wire: 0.59" (15.00mm); Mounting Type: Through Hole; Package / Case: Bead; ComponentLink1URL: http://www.vishay.com/docs/29049/ntcle100.pdf; ComponentLink1Description: http://www.vishay.com/docs/29049/ntcle100.pdf
SW2 = PTS645SM43SMTR92 LFS: SWITCH TACTILE SPST-NO 0.05A 12V; Manufacturer: C&K Components; Switch Function: Off-Mom; Contact Rating @ Voltage: 0.05A @ 12VDC; Actuator Type: Standard; Actuator Height off PCB, from Pins: 4.30mm; Actuator Orientation: Top Actuated; Outline: 6.00mm x 6.00mm; Illumination: Non-Illuminated; Operating Force: 160gf; Actuator Material: Polyamide (PA66), Nylon 6/6; Mechanical Life: 100,000 Cycles; Supplier 1: Digi-Key; Supplier Part Number 1: CKN9112CT-ND; Manufacturer Part Number: PTS645SM43SMTR92 LFS; RoHS: RoHS Compliant; Category: Switches; Stock 1: 189506; Pricing 1: 1=0.44, 10=0.425, 25=0.4108, 50=0.3958, 100=0.3737, 250=0.35176, 500=0.33708 (CAD); Packaging: Cut Tape (CT); Circuit: SPST-NO; Mounting Type: Surface Mount; Termination Style: Gull Wing; Illumination Voltage (Nominal): -; Illumination Type, Color: -; Ingress Protection: -; Switch Travel: -; Operating Temperature: -20°C ~ 60°C; ComponentLink1URL: http://media.digikey.com/pdf/Data%20Sheets/C&K/PTS645_Series.pdf; ComponentLink1Description: http://media.digikey.com/pdf/Data%20Sheets/C&K/PTS645_Series.pdf
U3 = BQ7692003PWR: IC BATT MGMT LI-ION AFE 20TSSOP; Manufacturer: Texas Instruments; Battery Chemistry: Multi-Chemistry; Number of Cells: 3 ~ 5; Fault Protection: Over Current, Over/Under Voltage, Short Circuit; Interface: I²C; Drawing Number: 296; 4040064-5; PW; 20; Supplier 1: Digi-Key; Supplier Part Number 1: 296-39959-1-ND; Manufacturer Part Number: BQ7692003PWR; RoHS: RoHS Compliant; Category: Integrated Circuits (ICs); Stock 1: 717; Pricing 1: 1=5.25, 10=4.703, 100=3.858, 500=3.28222, 1000=2.39928 (CAD); Packaging: Cut Tape (CT); Operating Temperature: -40°C ~ 85°C (TA); Package / Case: 20-TSSOP (0.173", 4.40mm Width); Supplier Device Package: 20-TSSOP; ComponentLink1URL: http://www.ti.com/lit/ds/symlink/bq76920.pdf; ComponentLink1Description: http://www.ti.com/lit/ds/symlink/bq76920.pdf